# EAGLE design controllerboard (EAGLE 5.11)
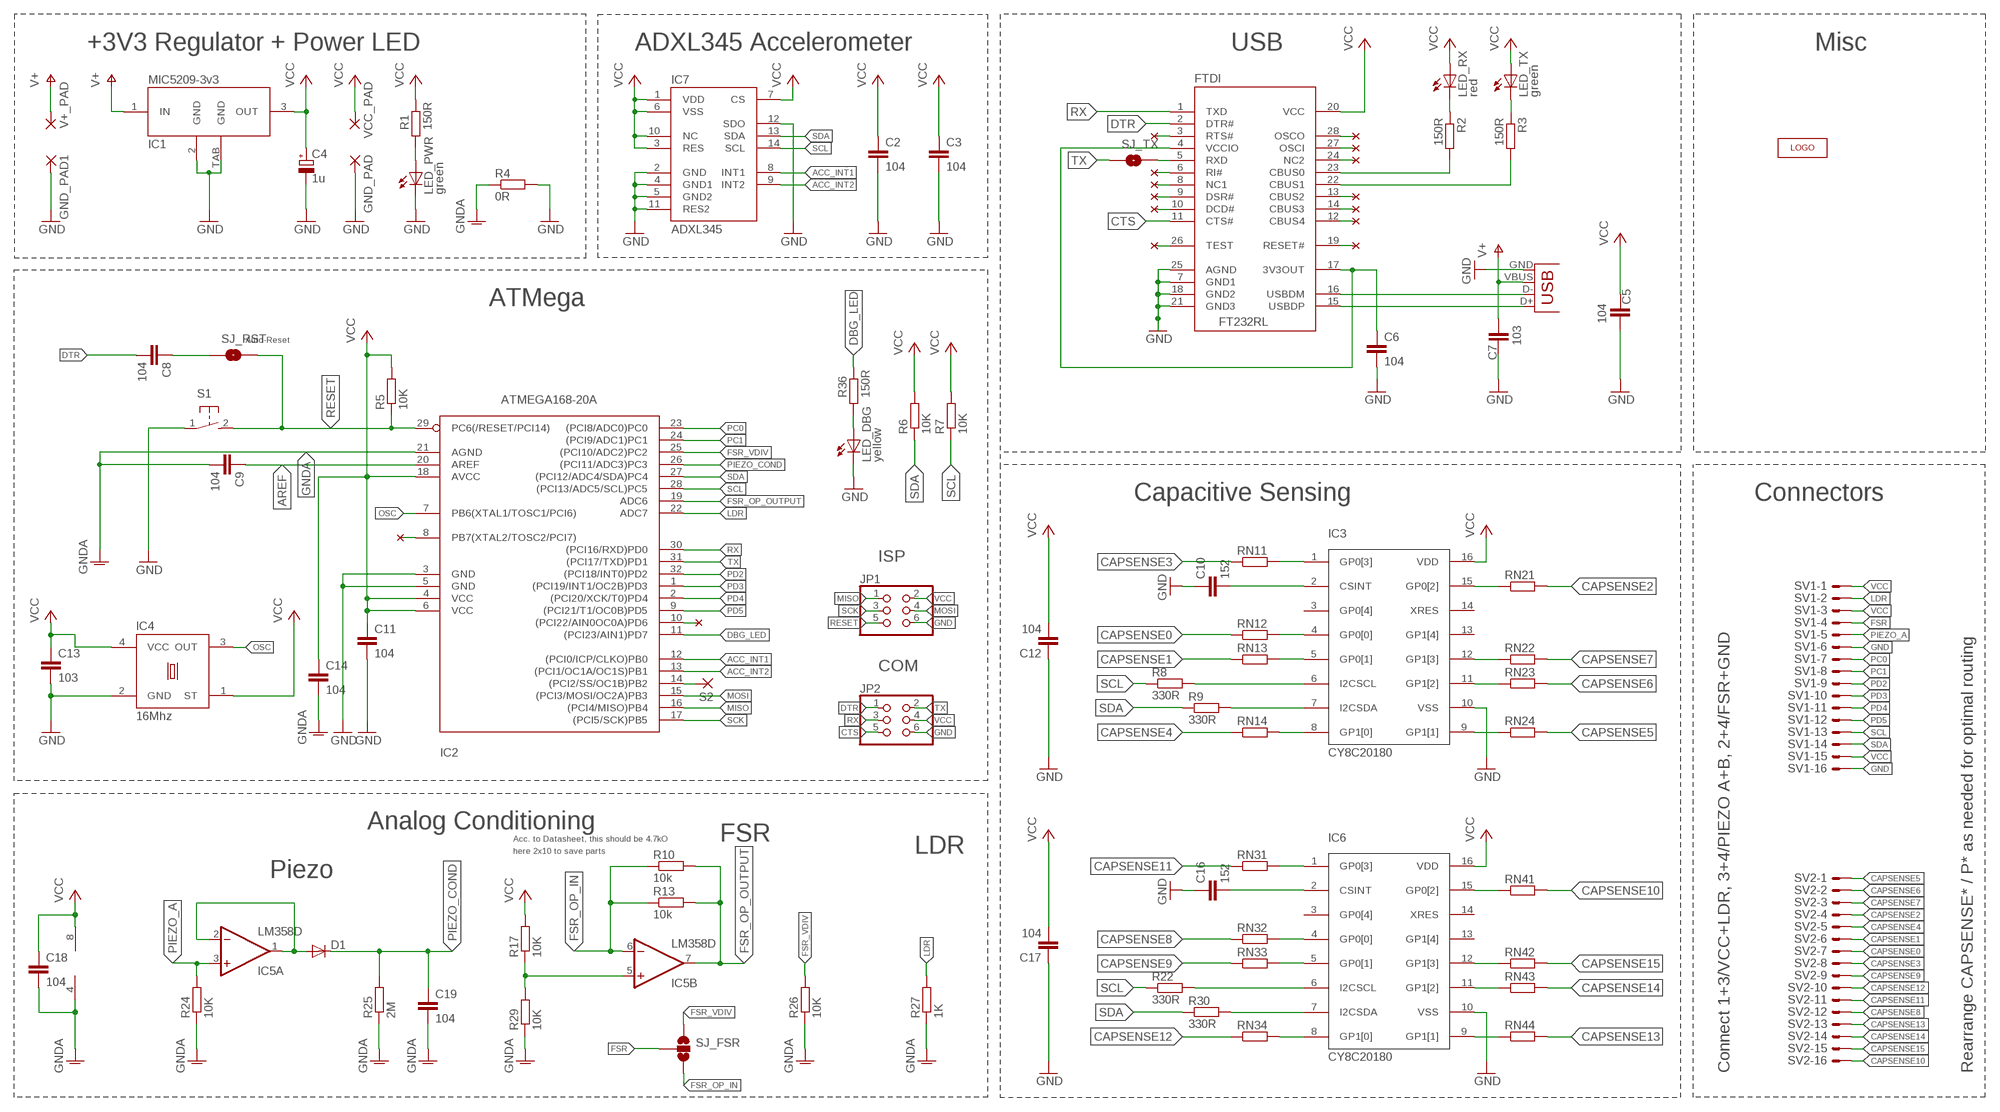
[diagram p0: schematic, sheet 1]

## Parts
C2  104  C-EUC0603K  [C0603K]
C3  104  C-EUC0603K  [C0603K]
C4  1u  CPOL-EUSMCA  [SMC_A]
C5  104  C-EUC0603K  [C0603K]
C6  104  C-EUC0603K  [C0603K]
C7  103  C-EUC0603K  [C0603K]
C8  104  C-EUC0603K  [C0603K]
C9  104  C-EUC0603K  [C0603K]
C10  152  C-EUC0603K  [C0603K]
C11  104  C-EUC0603K  [C0603K]
C12  104  C-EUC0603K  [C0603K]
C13  103  C-EUC0603K  [C0603K]
C14  104  C-EUC0603K  [C0603K]
C16  152  C-EUC0603K  [C0603K]
C17  104  C-EUC0603K  [C0603K]
C18  104  C-EUC0603K  [C0603K]
C19  104  C-EUC0603K  [C0603K]
D1  DIODESOD  [SOD-323]
FTDI  FT232RL  [SSOP28]
GND_PAD  WIREPADSMD1,27-254  [SMD1,27-2,54]
GND_PAD1  WIREPADSMD1,27-254  [SMD1,27-2,54]
IC1  MIC5209-3v3  MIC5209  [SOT223]
IC2  ATMEGA168-20A  [TQFP32-08]
IC3  CY8C20180  [SO16]
IC4  16Mhz  CB3  [CB3]
IC5  LM358D  [SO08]
IC6  CY8C20180  [SO16]
IC7  ADXL345  [LGA14]
JP1  PINHD-2X3  [2X03]
JP2  PINHD-2X3  [2X03]
LED_DBG  yellow  LEDCHIPLED_0603  [CHIPLED_0603]
LED_PWR  green  LEDCHIPLED_0603  [CHIPLED_0603]
LED_RX  red  LEDCHIPLED_0603  [CHIPLED_0603]
LED_TX  green  LEDCHIPLED_0603  [CHIPLED_0603]
R1  150R  R-EU_R0603  [R0603]
R2  150R  R-EU_R0603  [R0603]
R3  150R  R-EU_R0603  [R0603]
R4  0R  R-EU_R0603  [R0603]
R5  10K  R-EU_R0603  [R0603]
R6  10K  R-EU_R0603  [R0603]
R7  10K  R-EU_R0603  [R0603]
R8  330R  R-EU_R0603  [R0603]
R9  330R  R-EU_R0603  [R0603]
R10  10k  R-EU_R0603  [R0603]
R13  10k  R-EU_R0603  [R0603]
R17  10K  R-EU_R0603  [R0603]
R22  330R  R-EU_R0603  [R0603]
R24  10K  R-EU_R0603  [R0603]
R25  2M  R-EU_R0603  [R0603]
R26  10K  R-EU_R0603  [R0603]
R27  1K  R-EU_R0603  [R0603]
R29  10K  R-EU_R0603  [R0603]
R30  330R  R-EU_R0603  [R0603]
R36  150R  R-EU_R0603  [R0603]
RN1  RESISTOR_NETWORK_4-742C083  [742C083]
RN2  RESISTOR_NETWORK_4-742C083  [742C083]
RN3  RESISTOR_NETWORK_4-742C083  [742C083]
RN4  RESISTOR_NETWORK_4-742C083  [742C083]
S1  B3U-1000P  [B3U-1000P]
S2  PAD0.8X0.5  [PAD_0.8X0.5]
SJ_FSR  SOLDERJUMPER_2WAYPASTE1&2  [SJ_3_PASTE1&2]
SJ_RST  SOLDERJUMPERTRACE  [SJ_2S-TRACE]
SJ_TX  SOLDERJUMPERTRACE  [SJ_2S-TRACE]
SV1  ML16E  [ML16]
SV2  ML16E  [ML16]
U$1  LOGO  [LOGO]
V+_PAD  WIREPADSMD1,27-254  [SMD1,27-2,54]
VCC_PAD  WIREPADSMD1,27-254  [SMD1,27-2,54]
X2  USBSMD  [USB-MINIB]

## Nets
ACC_INT1: IC2.12((PCI0/ICP/CLKO)PB0) IC7.8(INT1)
ACC_INT2: IC2.13((PCI1/OC1A/OC1S)PB1) IC7.9(INT2)
AREF: C9.1 IC2.20(AREF)
CAPSENSE0: RN1.P$3 SV2.7
CAPSENSE1: RN1.P$5 SV2.6
CAPSENSE2: RN2.P$2 SV2.4
CAPSENSE3: RN1.P$1 SV2.8
CAPSENSE4: RN1.P$7 SV2.5
CAPSENSE5: RN2.P$8 SV2.1
CAPSENSE6: RN2.P$6 SV2.2
CAPSENSE7: RN2.P$4 SV2.3
CAPSENSE8: RN3.P$3 SV2.12
CAPSENSE9: RN3.P$5 SV2.9
CAPSENSE10: RN4.P$2 SV2.16
CAPSENSE11: RN3.P$1 SV2.11
CAPSENSE12: RN3.P$7 SV2.10
CAPSENSE13: RN4.P$8 SV2.13
CAPSENSE14: RN4.P$6 SV2.14
CAPSENSE15: RN4.P$4 SV2.15
CTS: FTDI.11(CTS#) JP2.5
DBG_LED: IC2.11((PCI23/AIN1)PD7) R36.2
DTR: C8.2 FTDI.2(DTR#) JP2.1
FSR: SJ_FSR.2 SV1.4
FSR_OP_IN: IC5.6(B:-IN) R10.1 R13.1 SJ_FSR.3
FSR_OP_OUTPUT: IC2.19(ADC6) IC5.7(B:OUT) R10.2 R13.2
FSR_VDIV: IC2.25((PCI10/ADC2)PC2) R26.2 SJ_FSR.1
GND: C2.2 C3.2 C4.- C5.2 C6.2 C7.1 C10.1 C11.2 C12.1 C13.2 C16.1 C17.1 FTDI.7(GND1) FTDI.18(GND2) FTDI.21(GND3) FTDI.25(AGND) GND_PAD1.1(P) GND_PAD.1(P) IC1.2(GND) IC1.TAB(GND) IC2.3(GND) IC2.5(GND) IC3.10(VSS) IC4.2(GND) IC6.10(VSS) IC7.2(GND) IC7.4(GND1) IC7.5(GND2) IC7.11(RES2) IC7.12(SDO) JP1.6 JP2.6 LED_DBG.C LED_PWR.C R4.2 S1.1 SV1.6 SV1.16 X2.GND
GNDA: C9.2 C14.2 C18.2 C19.2 IC2.21(AGND) IC5.4(P:V-) R4.1 R24.1 R25.1 R26.1 R27.1 R29.1
LDR: IC2.22(ADC7) R27.2 SV1.2
MISO: IC2.16((PCI4/MISO)PB4) JP1.1
MOSI: IC2.15((PCI3/MOSI/OC2A)PB3) JP1.4
N$1: D1.2(A) IC5.1(A:OUT) IC5.2(A:-IN)
N$2: LED_DBG.A R36.1
N$4: FTDI.5(RXD) SJ_TX.2
N$6: C6.1 FTDI.4(VCCIO) FTDI.17(3V3OUT)
N$7: IC5.5(B:+IN) R17.1 R29.2
N$8: IC3.1(GP0[3]) RN1.P$2
N$9: IC3.4(GP0[0]) RN1.P$4
N$10: IC3.5(GP0[1]) RN1.P$6
N$11: IC2.14((PCI2/SS/OC1B)PB2) S2.P$1(P)
N$12: IC3.8(GP1[0]) RN1.P$8
N$13: IC3.15(GP0[2]) RN2.P$1
N$14: IC3.12(GP1[3]) RN2.P$3
N$15: IC3.11(GP1[2]) RN2.P$5
N$16: IC3.9(GP1[1]) RN2.P$7
N$17: IC6.1(GP0[3]) RN3.P$2
N$18: IC6.4(GP0[0]) RN3.P$4
N$19: IC6.5(GP0[1]) RN3.P$6
N$20: C10.2 IC3.2(CSINT)
N$21: IC6.8(GP1[0]) RN3.P$8
N$22: IC6.15(GP0[2]) RN4.P$1
N$23: IC6.12(GP1[3]) RN4.P$3
N$24: IC6.11(GP1[2]) RN4.P$5
N$25: IC6.9(GP1[1]) RN4.P$7
N$27: IC2.10((PCI22/AIN0OC0A)PD6)
N$28: IC2.8(PB7(XTAL2/TOSC2/PCI7))
N$30: IC3.6(I2CSCL) R8.2
N$31: IC3.7(I2CSDA) R9.2
N$40: FTDI.15(USBDP) X2.D+
N$41: FTDI.16(USBDM) X2.D-
N$42: FTDI.23(CBUS0) R2.2
N$43: FTDI.22(CBUS1) R3.2
N$45: FTDI.6(RI#)
N$46: FTDI.8(NC1)
N$47: FTDI.9(DSR#)
N$48: FTDI.10(DCD#)
N$49: FTDI.28(OSCO)
N$50: FTDI.27(OSCI)
N$51: FTDI.24(NC2)
N$52: FTDI.13(CBUS2)
N$53: FTDI.14(CBUS3)
N$54: FTDI.12(CBUS4)
N$55: FTDI.19(RESET#)
N$56: FTDI.26(TEST)
N$57: FTDI.3(RTS#)
N$59: LED_RX.C R2.1
N$60: LED_TX.C R3.1
N$65: C16.2 IC6.2(CSINT)
N$66: IC6.6(I2CSCL) R22.2
N$67: IC6.7(I2CSDA) R30.2
N$68: LED_PWR.A R1.1
N$89: C8.1 SJ_RST.1
OSC: IC2.7(PB6(XTAL1/TOSC1/PCI6)) IC4.3(OUT)
PC0: IC2.23((PCI8/ADC0)PC0) SV1.7
PC1: IC2.24((PCI9/ADC1)PC1) SV1.8
PD2: IC2.32((PCI18/INT0)PD2) SV1.9
PD3: IC2.1((PCI19/INT1/OC2B)PD3) SV1.10
PD4: IC2.2((PCI20/XCK/T0)PD4) SV1.11
PD5: IC2.9((PCI21/T1/OC0B)PD5) SV1.12
PIEZO_A: IC5.3(A:+IN) R24.2 SV1.5
PIEZO_COND: C19.1 D1.1(C) IC2.26((PCI11/ADC3)PC3) R25.2
RESET: IC2.29(PC6(/RESET/PCI14)) JP1.5 R5.1 S1.2 SJ_RST.2
RX: FTDI.1(TXD) IC2.30((PCI16/RXD)PD0) JP2.3
SCK: IC2.17((PCI5/SCK)PB5) JP1.3
SCL: IC2.28((PCI13/ADC5/SCL)PC5) IC7.14(SCL) R7.1 R8.1 R22.1 SV1.13
SDA: IC2.27((PCI12/ADC4/SDA)PC4) IC7.13(SDA) R6.1 R9.1 R30.1 SV1.14
TX: IC2.31((PCI17/TXD)PD1) JP2.2 SJ_TX.1
V+: C7.2 IC1.1(IN) V+_PAD.1(P) X2.VBUS
VCC: C2.1 C3.1 C4.+ C5.1 C11.1 C12.2 C13.1 C14.1 C17.2 C18.1 FTDI.20(VCC) IC1.3(OUT) IC2.4(VCC) IC2.6(VCC) IC2.18(AVCC) IC3.16(VDD) IC4.1(ST) IC4.4(VCC) IC5.8(P:V+) IC6.16(VDD) IC7.1(VDD) IC7.3(RES) IC7.6(VSS) IC7.7(CS) IC7.10(NC) JP1.2 JP2.4 LED_RX.A LED_TX.A R1.2 R5.2 R6.2 R7.2 R17.2 SV1.1 SV1.3 SV1.15 VCC_PAD.1(P)
Unconnected: IC3.3(GP0[4]) IC3.13(GP1[4]) IC3.14(XRES) IC6.3(GP0[4]) IC6.13(GP1[4]) IC6.14(XRES)

## Notes on the sheet
- +3V3 Regulator + Power LED | ADXL345 Accelerometer | USB | Misc
- ATMega
- Auto-Reset
- Capacitive Sensing | Connectors
- ISP
- COM
- Analog Conditioning
- Acc. to Datasheet, this should be 4.7kO | FSR
- here 2x10 to save parts | LDR
- Piezo
- Connect 1+3/VCC+LDR, 3+4/PIEZO A+B, 2+4/FSR+GND | Rearrange CAPSENSE* / P* as needed for optimal routing

## Library data of the parts
C2 C3 C5-C14 C16-C19 = rcl:C-EU: CAPACITOR, European symbol
C4 = rcl:CPOL-EU: POLARIZED CAPACITOR, European symbol
D1 = SparkFun:DIODE: Diode These are standard reverse protection diodes and small signal diodes. SMA package can handle up to about 1A. SOD-323 can handle about 200mA. What the SOD-323 package when ordering, there are some mfgs out there that are 5-pin packages.
FTDI = MySMD:FT232RL
GND_PAD GND_PAD1 V+_PAD VCC_PAD = wirepad:WIREPAD: Wire PAD connect wire on PCB
IC1 = vreg:MIC5209: MIC5209 voltage regulator
IC2 = avr:ATMEGA168: MICROCONTROLLER 16 kBytes FLASH 1 kBytes SRAM 512 Bytes EEPROM USART 8-channel 10 bit ADC
IC3 IC6 = sensors:CY8C20180: Cypress CY8C20180 CapSense Express 8-Channel Capacitive Button Controler
IC4 = crystals:CB3: Model CB3 & CB3LV HCMOS/TTL CLOCK OSCILLATOR Standard 7.0x5.0mm Surface Mount Footprint HCMOS/TTL Compatible Fundamental and 3RD Overtone Crystals ? Frequency Range 1.5 ? 160 MHz Frequency Stability, ±50 ppm Standard (±25 ppm and ±20 ppm available) +3.3Vdc or +5.0Vdc Operation Datasheet <http://www.ctscorp.com/components/Datasheets/008-0256-0_F.pdf>
IC5 = linear:LM358: OP AMP also LM158; LM258; LM2904 Source: http://cache.national.com/ds/LM/LM158.pdf
IC7 = sensors:ADXL345: ADXL345 Digital 3-axis Accelerometer Original Footprint by SparkFun, revised & corrected.
JP1 JP2 = pinhead:PINHD-2X3: PIN HEADER
LED_DBG LED_PWR LED_RX LED_TX = led:LED: LED OSRAM: - CHIPLED LG R971, LG N971, LY N971, LG Q971, LY Q971, LO R971, LY R971 LH N974, LH R974 LS Q976, LO Q976, LY Q976 LO Q996 - Hyper CHIPLED LW Q18S LB Q993, LB Q99A, LB R99A - SideLED LS A670, LO A670, LY A670, LG A670, LP A670 LB A673, LV A673, LT A673, LW A673 LH A674 LY A675 LS A676, LA A676, LO A676, LY A676, LW A676 LS A679, LY A679, LG A679 - Hyper Micro SIDELED® LS Y876, LA Y876, LO Y876, LY Y876 LT Y87S - SmartLED LW L88C, LW L88S LB L89C, LB L89S, LG L890 LS L89K, LO L89K, LY L89K LS L896, LA L896, LO L896, LY L896 - TOPLED LS T670, LO T670, LY T670, LG T670, LP T670 LSG T670, LSP T670, LSY T670, LOP T670, LYG T670 LG T671, LOG T671, LSG T671 LB T673, LV T673, LT T673, LW T673 LH T674 LS T676, LA T676, LO T676, LY T676, LB T676, LH T676, LSB T676, LW T676 LB T67C, LV T67C, LT T67C, LS T67K, LO T67K, LY T67K, LW E67C LS E67B, LA E67B, LO E67B, LY E67B, LB E67C, LV E67C, LT E67C LW T67C LS T679, LY T679, LG T679 LS T770, LO T770, LY T770, LG T770, LP T770 LB T773, LV T773, LT T773, LW T773 LH T774 LS E675, LA E675, LY E675, LS T675 LS T776, LA T776, LO T776, LY T776, LB T776 LHGB T686 LT T68C, LB T68C - Hyper Mini TOPLED® LB M676 - Mini TOPLED Santana® LG M470 LS M47K, LO M47K, LY M47K Source: http://www.osram.convergy.de LUXEON: - LUMILED® LXK2-PW12-R00, LXK2-PW12-S00, LXK2-PW14-U00, LXK2-PW14-V00 LXK2-PM12-R00, LXK2-PM12-S00, LXK2-PM14-U00 LXK2-PE12-Q00, LXK2-PE12-R00, LXK2-PE12-S00, LXK2-PE14-T00, LXK2-PE14-U00 LXK2-PB12-K00, LXK2-PB12-L00, LXK2-PB12-M00, LXK2-PB14-N00, LXK2-PB14-P00, LXK2-PB14-Q00 LXK2-PR12-L00, LXK2-PR12-M00, LXK2-PR14-Q00, LXK2-PR14-R00 LXK2-PD12-Q00, LXK2-PD12-R00, LXK2-PD12-S00 LXK2-PH12-R00, LXK2-PH12-S00 LXK2-PL12-P00, LXK2-PL12-Q00, LXK2-PL12-R00 Source: www.luxeon.com KINGBRIGHT: KA-3528ASYC Source: www.kingbright.com
R1-R10 R13 R17 R22 R24-R27 R29 R30 R36 = rcl:R-EU_: RESISTOR, European symbol
RN1-RN4 = resistor:RESISTOR_NETWORK_4: Resistor Network/Array with 4 single resistors in a package
S1 = switch:B3U: Ultra-small Tactile Switch B3U Ultra-small-sized Tactile Switch with High Contact Reliability: 1.2 x 3 x 2.5 mm (H x W x D) Datasheet <http://components.omron.com/components/web/pdflib.nsf/0/2DD3893C7DD33E9E862572900079E9D6/$file/B3U_1110.pdf> Digi-Key Part Number SW1020CT-ND
S2 = connector:PAD
SJ_FSR = SparkFun:SOLDERJUMPER_2WAY: Solder Jumper 2 way solder jumper
SJ_RST SJ_TX = SparkFun:SOLDERJUMPER: Solder Jumper Standard SMD solder jumper. Used to automate production. Two varients : Normally Open and Normally Closed are the same, but have different paste layers. NC will have a large amount of paste and should jumper during reflow.
SV1 SV2 = con-harting-ml:ML16?E: HARTING; OC_FARNELL: unknown; OC_NEWARK: unknown
U$1 = own:LOGO
X2 = SparkFun:USB: USB Connectors USB-B-PTH is fully proven SKU : PRT-00139 USB-miniB is fully proven SKU : PRT-00587 USB-A-PCB is untested. USB-A-H is throughly reviewed, but untested. Spark Fun Electronics SKU : PRT-00437 USB-B-SMT is throughly reviewed, but untested. Needs silkscreen touching up. USB-A-S has not been used/tested USB-MB-H has not been used/tested

## Board
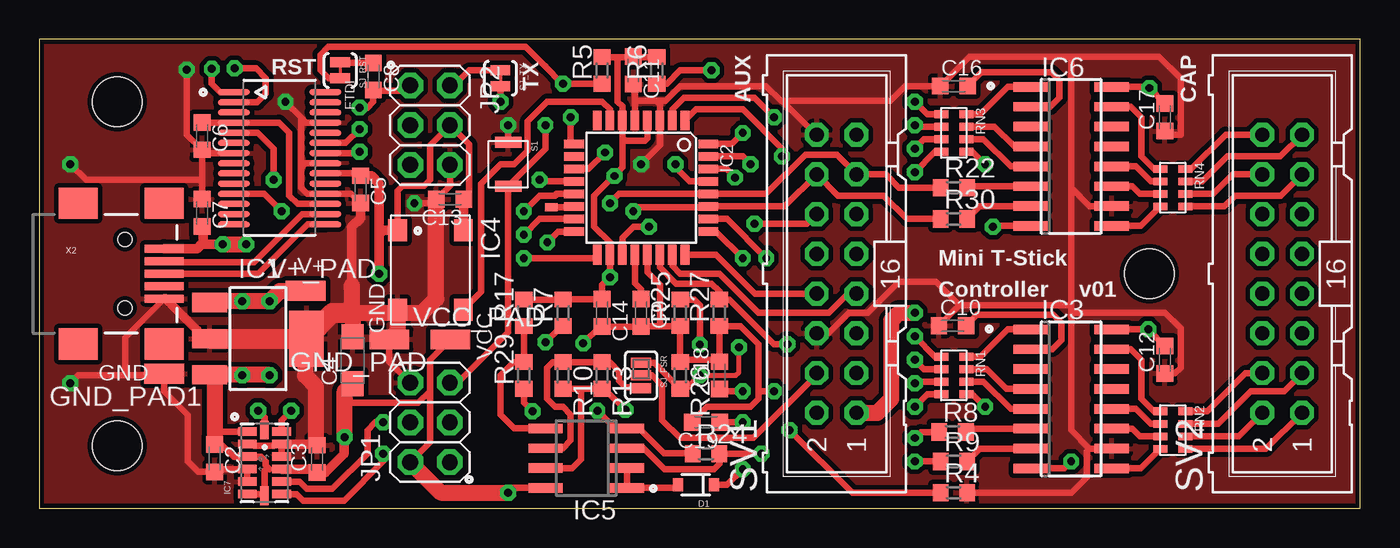
[diagram p1: board, top side]
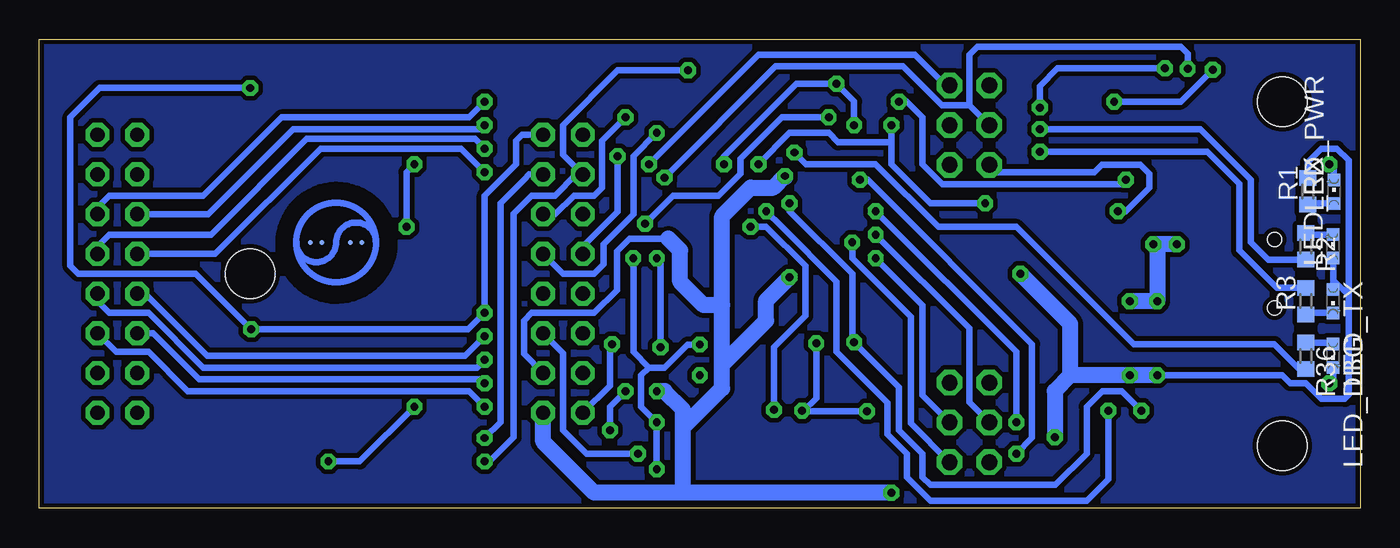
[diagram p2: board, bottom side, seen from below]

Size 84.5 x 30 mm. Coordinates in mm from the lower left corner, seen from the top.
Outline: 0,0 84.5,0 84.5,30 0,30 0,0
Copper layers (1*16): Top 0.035mm / dielectric 1.5mm / Bottom 0.035mm
Design rules "APC *": minimum track width 7mil, minimum drill 20mil, track to track 7mil, track to pad 7mil, pad to pad 7mil, via to via 7mil, smd to smd 0mil, copper to edge 8mil, drill to drill 8mil, minimum pad ring 12mil, minimum via ring 10mil, stop-mask expansion 4mil, vias tented up to drill 25mil, thermal gap 10mil
Holes 3.17 mm at 71,15 5,26 5,4
bRestrict: area 62.1,13.6 to 68.9,20.4

### Footprints (pad centres in the part's own frame; a part is rotated, then mirrored left to right if it is on the bottom)
C0603K = smd 1.05 x 1.08: 1 -0.875,0; 2 0.875,0
SMC_A = smd 1.6 x 1.4: + -1.5,0; - 1.5,0
SOD-323 = smd 0.63 x 0.83: 1 -1.15,0; 2 1.15,0
SSOP28 = smd 0.381 x 2.032: 1 0,0; 2 0.65,0; 3 1.3,0; 4 1.95,0; 5 2.6,0; 6 3.25,0; 7 3.9,0; 8 4.55,0; 9 5.2,0; 10 5.85,0; 11 6.5,0; 12 7.15,0; 13 7.8,0; 14 8.45,0; 15 8.45,5.848; 16 7.8,5.848; 17 7.15,5.848; 18 6.5,5.848; 19 5.85,5.848; 20 5.2,5.848; 21 4.55,5.848; 22 3.9,5.848; 23 3.25,5.848; 24 2.6,5.848; 25 1.95,5.848; 26 1.3,5.848; 27 0.65,5.848; 28 0,5.848
SMD1,27-2,54 = smd 1.27 x 2.54: 1 0,0
SOT223 = smd 1.219 x 2.235: 1 -2.311,-3.099; 2 0,-3.099; 3 2.311,-3.099 | smd 3.6 x 2.2: TAB 0,3.099
TQFP32-08 = smd 1.27 x 0.559: 1 -4.293,2.8; 2 -4.293,2; 3 -4.293,1.2; 4 -4.293,0.4; 5 -4.293,-0.4; 6 -4.293,-1.2; 7 -4.293,-2; 8 -4.293,-2.8; 17 4.293,-2.8; 18 4.293,-2; 19 4.293,-1.2; 20 4.293,-0.4; 21 4.293,0.4; 22 4.293,1.2; 23 4.293,2; 24 4.293,2.8 | smd 0.559 x 1.27: 9 -2.8,-4.293; 10 -2,-4.293; 11 -1.2,-4.293; 12 -0.4,-4.293; 13 0.4,-4.293; 14 1.2,-4.293; 15 2,-4.293; 16 2.8,-4.293; 25 2.8,4.293; 26 2,4.293; 27 1.2,4.293; 28 0.4,4.293; 29 -0.4,4.293; 30 -1.2,4.293; 31 -2,4.293; 32 -2.8,4.293
SO16 = smd 0.6 x 2.2: 1 -4.445,-2.6; 2 -3.175,-2.6; 3 -1.905,-2.6; 4 -0.635,-2.6; 5 0.635,-2.6; 6 1.905,-2.6; 7 3.175,-2.6; 8 4.445,-2.6; 9 4.445,2.6; 10 3.175,2.6; 11 1.905,2.6; 12 0.635,2.6; 13 -0.635,2.6; 14 -1.905,2.6; 15 -3.175,2.6; 16 -4.445,2.6
CB3 = smd 1.4 x 1.2: 1 -2.54,-2.1; 2 2.54,-2.1; 3 2.54,2.1; 4 -2.54,2.1
SO08 = smd 0.6 x 2.2: 1 -1.905,-2.6; 2 -0.635,-2.6; 3 0.635,-2.6; 4 1.905,-2.6; 5 1.905,2.6; 6 0.635,2.6; 7 -0.635,2.6; 8 -1.905,2.6
LGA14 = smd 0.55 x 1.2: 1 2,1.1; 2 1.2,1.1; 3 0.4,1.1; 4 -0.4,1.1; 5 -1.2,1.1; 6 -2,1.1; 8 -2,-1.1; 9 -1.2,-1.1; 10 -0.4,-1.1; 11 0.4,-1.1; 12 1.2,-1.1; 13 2,-1.1 | smd 1.2 x 0.55: 7 -2.1,0; 14 2.1,0
2X03 = drill 1.016 octagon: 1 -2.54,-1.27; 2 -2.54,1.27; 3 0,-1.27; 4 0,1.27; 5 2.54,-1.27; 6 2.54,1.27
CHIPLED_0603 = smd 0.8 x 0.8: A 0,-0.75; C 0,0.75
R0603 = smd 1 x 1.1: 1 -0.85,0; 2 0.85,0
742C083 = smd 0.5 x 0.9: P$1 -1.2,-0.8; P$2 -1.2,0.8; P$3 -0.4,-0.8; P$4 -0.4,0.8; P$5 0.4,-0.8; P$6 0.4,0.8; P$7 1.2,-0.8; P$8 1.2,0.8
B3U-1000P = smd 0.7 x 1.7: 1 -1.4,0; 2 1.4,0
PAD_0.8X0.5 = smd 0.8 x 0.5: P$1 0,0
SJ_3_PASTE1&2 = smd 0.635 x 1.27: 1 -0.813,0; 2 0,0; 3 0.813,0
SJ_2S-TRACE = smd 0.635 x 1.27: 1 -0.508,0; 2 0.508,0
ML16 = drill 0.914 octagon: 1 -8.89,-1.27; 2 -8.89,1.27; 3 -6.35,-1.27; 4 -6.35,1.27; 5 -3.81,-1.27; 6 -3.81,1.27; 7 -1.27,-1.27; 8 -1.27,1.27; 9 1.27,-1.27; 10 1.27,1.27; 11 3.81,-1.27; 12 3.81,1.27; 13 6.35,-1.27; 14 6.35,1.27; 15 8.89,-1.27; 16 8.89,1.27
LOGO = smd 0.305 x 0.305: P$1 -1.657,0; P$2 -0.921,0; P$3 0.921,0; P$4 1.657,0
USB-MINIB = smd 2.5 x 0.5: D+ 2.5,0; D- 2.5,0.8; GND 2.5,-1.6; ID 2.5,-0.8; VBUS 2.5,1.6 | smd 2.5 x 2: MTN1 -3,4.5; MTN2 2.5,4.5; MTN3 -3,-4.5; MTN4 2.5,-4.5 | hole 0.9: 0,2.2; 0,-2.2

### Placement (x,y rotation side)
C2  11.23,3.21 270 top
C3  17.77,3.16 90 top
C4  20.05,9.46 90 top
C5  20.55,20.39 270 top
C6  10.42,23.8 270 top
C7  10.43,18.89 270 top
C8  21.38,27.61 270 top
C9  38.5,12.5 270 top
C10  58.42,11.68 0 top
C11  38,28 270 top
C12  72,9.5 90 top
C13  26.27,19.75 180 top
C14  36,12.5 270 top
C16  58.5,27 0 top
C17  72,25 90 top
C18  43.5,8.5 90 top
C19  42.65,5.5 180 top
D1  42,1.5 180 top
FTDI  12.45,26.61 270 top
GND_PAD  22.4,10.8 90 top
GND_PAD1  8,8.61 90 top
IC1  14,10.85 270 top
IC2  38.5,20.5 270 top
IC3  66,7 270 top
IC4  25.02,15.25 270 top
IC5  34.99,3.21 90 top
IC6  66,22.5 270 top
IC7  14.42,2.91 90 top
JP1  25,5.5 90 top
JP2  25,24.5 270 top
LED_DBG  1.75,9.75 180 bottom
LED_PWR  1.69,20.25 0 bottom
LED_RX  1.75,16.75 0 bottom
LED_TX  1.75,13.25 180 bottom
R1  3.36,20.27 90 bottom
R2  3.5,16.75 270 bottom
R3  3.5,13.25 90 bottom
R4  58.5,1 0 top
R5  36,28 90 top
R6  39.5,28 90 top
R7  33.5,12.5 90 top
R8  58.42,4.88 0 top
R9  58.5,3 0 top
R10  33.5,8.5 270 top
R13  36,8.5 270 top
R17  31,12.5 90 top
R22  58.5,20.5 0 top
R24  42.65,3.5 0 top
R25  41,12.5 90 top
R26  41,8.5 270 top
R27  43.5,12.5 90 top
R29  31,8.5 90 top
R30  58.5,18.5 0 top
R36  3.5,9.75 270 bottom
RN1  58.5,8.5 270 top
RN2  72.5,5 270 top
RN3  58.5,24 270 top
RN4  72.5,20.5 270 top
S1  30,22 270 top
S2  32.75,19.25 0 top
SJ_FSR  38.5,8.5 270 top
SJ_RST  19.25,28 270 top
SJ_TX  29.5,27.5 270 top
SV1  51,15 90 top
SV2  79.5,15 90 top
U$1  65.5,17 0 bottom
V+_PAD  17.05,13.91 270 top
VCC_PAD  26.3,10.8 270 top
X2  5.5,15 0 top

### Tracks (layer width: path | path; a pad name or v marks a point on that pad's centre or on a via)
ACC_INT1  (via drill 0.51)
  Top 0.406: IC7.8 16.46,0.91 16.88,0.5 19.5,0.5 22,3 v22,3.5 | IC2.12 32.1,20.9 v32,21
  Bottom 0.406: v32,21 31.5,21 21,10.5 21,4.5 v22,3.5
ACC_INT2  (via drill 0.51)
  Top 0.406: IC7.9 16.66,1.71 17.12,1.25 18.75,1.25 21,3.5 21,5 21.5,5.5 v22,5.5 | IC2.13 33.1,20.1 33,20 32,20 v31,19
  Bottom 0.406: v22,5.5 22,10 v31,19
AREF
  Top 0.406: IC2.20 38.1,14.4 38.5,14 C9.1
CAPSENSE0  (via drill 0.51)
  Top 0.406: RN1.P$3 56.6,8.9 v56,9.5
  Bottom 0.406: v56,9.5 56.5,9 74,9 77.5,12.5 80,12.5 80.77,13.27 SV2.7
CAPSENSE1  (via drill 0.51)
  Top 0.406: RN1.P$5 56.1,8.1 v56,8
  Bottom 0.406: v56,8 56.25,8.25 74.25,8.25 77.19,11.19 SV2.6
CAPSENSE2
  Top 0.406: SV2.4 77.15,8.65 74.7,6.2 RN2.P$2
CAPSENSE3  (via drill 0.51)
  Top 0.406: RN1.P$1 57.3,9.7 v56,11
  Bottom 0.406: v56,11 57.25,9.75 73.75,9.75 77.73,13.73 SV2.8
CAPSENSE4  (via drill 0.51)
  Top 0.406: RN1.P$7 56.8,7.3 v56,6.5
  Bottom 0.406: v56,6.5 57,7.5 75,7.5 77.5,10 79.58,10 SV2.5
CAPSENSE5
  Top 0.406: RN2.P$8 78.46,3.8 SV2.1
CAPSENSE6
  Top 0.406: RN2.P$6 76.72,4.6 SV2.2
CAPSENSE7
  Top 0.406: RN2.P$4 75.4,5.4 77.5,7.5 79.62,7.5 SV2.3
CAPSENSE8  (via drill 0.51)
  Top 0.406: RN3.P$3 56.1,24.4 v56,24.5
  Bottom 0.406: SV2.12 73.69,18.81 68.25,24.25 58.88,24.25 58.5,24.25 56.25,24.25 v56,24.5
CAPSENSE9  (via drill 0.51)
  Top 0.406: RN3.P$5 56.6,23.6 v56,23
  Bottom 0.406: SV2.9 80.77,16.73 80,17.5 73.5,17.5 67.38,23.62 59.5,23.62 59,23.62 56.62,23.62 v56,23
CAPSENSE10
  Top 0.406: RN4.P$2 73.7,21.7 75.89,23.89 SV2.16
CAPSENSE11  (via drill 0.51)
  Top 0.406: RN3.P$1 56.8,25.2 v56,26
  Bottom 0.406: SV2.11 80.77,19.23 80,20 74,20 69,25 57,25 v56,26
CAPSENSE12  (via drill 0.51)
  Top 0.406: RN3.P$7 57.3,22.8 v56,21.5
  Bottom 0.406: SV2.10 73.23,16.27 66.5,23 61,23 60.5,23 57.5,23 v56,21.5
CAPSENSE13
  Top 0.406: RN4.P$8 75.8,19.3 76.5,20 79.42,20 SV2.13
CAPSENSE14
  Top 0.406: RN4.P$6 75.1,20.1 76.35,21.35 SV2.14
CAPSENSE15
  Top 0.406: SV2.15 79.38,22.5 76,22.5 74.4,20.9 RN4.P$4
CTS  (via drill 0.51)
  Top 0.406: FTDI.11 14.39,20.11 v15.5,19
  Bottom 0.406: v15.5,19 15,19 13.5,20.5 13.5,21.4 14.06,21.96 16.54,21.96 17,21.5 23.27,21.5 JP2.5
DBG_LED  (via drill 0.51)
  Top 0.406: IC2.11 35.15,21.7 v36.2,22.75
  Bottom 0.406: R36.2 3.9,8.9 5.5,10.5 14.5,10.5 22,18 27,18 31,22 35.45,22 v36.2,22.75
DTR  (via drill 0.51)
  Top 0.406: JP2.1 23.82,27.04 23.48,26.7 21.41,26.7 C8.2 21.38,26 21,25.62 v20.5,25.62 | FTDI.2 13.96,25.96 14.5,26.5 14.5,27.5 13.88,28.12 v12.5,28.12
  Bottom 0.406: v20.5,25.62 20.5,27 19.38,28.12 v12.5,28.12
FSR
  Top 0.406: SV1.4 49.73,8.55 45.68,4.5 41,4.5 39.85,5.65 39.85,7.85 39.2,8.5 SJ_FSR.2
FSR_OP_IN
  Top 0.406: IC5.6 33.49,3.85 34,4.35 34,6 33.5,6.5 33,6.5 32.5,7 32.5,9 32.85,9.35 R10.1 R13.1 36.04,9.31 36.54,9.31 37.1,8.75 37.1,8.15 37.5,7.75 38.44,7.75 SJ_FSR.3
FSR_OP_OUTPUT  (via drill 0.51)
  Top 0.406: 34.65,7.65 R10.2 | 34.65,7.65 R13.2 36.15,7.5 36.3,7.5 v37.5,6.3 | 37.25,16.16 IC2.19 37.3,17.3 38,18 v39,18 | IC5.7 34.08,2.58 34.65,3.15 34.65,7.65
  Bottom 0.406: v37.5,6.3 37.5,10.3 35.5,12.3 35.5,15.5 38,18 v39,18
FSR_VDIV  (via drill 0.51)
  Top 0.305: v44.75,10.3 44.75,8.7 44.55,8.5 v42.25,8.5
  Top 0.406: 40.96,7.69 R26.2 | 40.96,7.69 41.44,7.69 v42.25,8.5 | IC2.25 43.3,17.7 v45,16 | 40.96,7.69 39.34,9.31 SJ_FSR.1
  Bottom 0.406: v44.75,10.3 44.75,15.75 v45,16
GND  (via drill 0.51)
  Top 0.406: 16.75,21.75 16.75,20.5 17.14,20.11 FTDI.18 19.95,20.11 C5.2 | FTDI.21 17.06,22.06 16.75,21.75 | FTDI.7 10.63,22.71 C6.2 | 16.75,21.75 16.75,25 | 16.75,25 v15.75,26 | 10.43,21 C7.1 | 10.43,21 10.43,22.91 C6.2 | IC7.11 IC7.12 15.11,4.11 15,4 13.75,4 13.64,4.11 IC7.2 | IC7.5 IC7.4 11.38,2.51 11.38,2.48 C2.2 10.16,2.33 9.5,3 9.5,6 8,7.5 GND_PAD1.1 7.99,8.62 7.38,8.62 7.25,8.5 5.5,8.5 | 17.7,4.11 C3.2 | C6.2 10.07,22.93 | 20.01,13.83 20.01,13.99 | 66,28.88 59.5,28.88 C16.1 55.38,27 54.44,26.06 47.5,26.06 | 66,28.88 66,20.5 | 66,20.5 67.17,19.32 IC6.10 | C17.1 72.23,23.89 73,23.89 73,27.5 71.62,28.88 66,28.88 | 58.87,13 C10.1 | 66,13 58.87,13 | 66,13 66,12.5 | 66,12.5 72,12.5 73,11.5 73,9 72.62,8.62 C12.1 | 66,20.5 66,13 | 66,12.5 66,5 67.17,3.83 | 67.17,3.83 IC3.10 | C11.2 38.1,27.02 38.1,26.06 | 38.1,26.06 IC2.5 | 39.44,26.06 38.1,26.06 | 39.44,26.06 39.7,25.8 IC2.3 39.7,23.2 | 39.44,26.06 40.06,26.06 41,27 46.5,27 47.44,26.06 47.5,26.06 | JP1.6 22.4,9.37 GND_PAD.1 | 30,23.5 29.5,23.5 | 30.5,23.5 30.4,23.4 S1.1 30,23.5 | C13.2 25.4,19.6 | v30,24.5 30,23.5 | C13.2 26.27,20.62 JP2.6 | FTDI.25 17.09,24.66 16.75,25 | v24,19.5 25.15,19.5 C13.2 | SV1.16 49.67,23.89 47.5,26.06 | 58.87,13 57.37,14.5 55,14.5 54.5,14 53,12.5 51.8,12.5 50.49,11.19 SV1.6 | v2,22 3,21 10.43,21 | v2,8 2.5,8.5 5.5,8.5 | 5.5,8.5 5.5,10.9 X2.GND | R4.2 66,1 67,2 67,3.65 67.17,3.83 | 39.7,23.2 | v38.5,22 39.7,23.2 | v9.45,28.05 9.45,23.89 C6.2
  Top 0.61: 17.7,4.11 IC7.12 | C5.2 20.55,18.55 20,18 20,14.25 | IC4.2 23.14,12.5 | X2.GND 8.1,13.4 10.12,11.38 10.12,11 10.38,10.75 10.8,10.75 IC1.2
  Top 1.016: 20.01,12.5 20.01,13.83 | 20.01,12.5 22.71,12.5 IC4.2 22.93,11.32 GND_PAD.1 | 23.14,12.5 24.5,12.5 25.4,13.4 C13.2 | 17.38,9.88 17.38,9.98 17.67,10.28 IC1.TAB 17,10.75 17,8.5 17.7,7.8 17.7,4.11 | C4.- 20.05,12.46 20.01,12.5 | 20,14.25 20,14 20.01,13.99
  Top 1.27: IC1.2 IC1.TAB 18.75,12.5 20.01,12.5
  Bottom 0.406: LED_PWR.C 1.69,21.69 v2,22 | LED_DBG.C 1.75,8.25 v2,8 | v24,19.5 27.5,19.5 30,22 S1.1 | v38.5,22 36.5,24 34,24 33.4,23.4 S1.1 | S1.1 v30,24.5 | v15.75,26 11.5,26 v9.45,28.05
  pour Top (isolate 0.305): 0,30 84.5,30 84.5,0 0,0
GNDA  (via drill 0.51)
  Top 0.406: R24.1 41.77,3.52 39.98,3.52 38.5,5 37.7,5 IC5.4 | C18.2 R27.1 44.85,11.65 46,10.5 46,7.5 | R29.1 31,6.75 v31.55,6.2 | IC5.4 | C19.2 41.77,5.58 42.7,6.5 45.5,6.5 46,7 46,7.5 | C18.2 43.52,9.35 | C18.2 43.38,9.5 41.15,9.5 R26.1 R25.1 39.7,11.65 | R4.1 52,1 v48,5 | 46,7.5 v47,7.5 | IC5.4 36.84,5.12 v35.7,6.25 | 39.7,11.65 38.52,11.65 C9.2 C14.2 35.88,11.62 v34.8,10.55 | IC2.21 38.9,15.1 39.7,14.3 39.7,11.65
  Bottom 0.406: v48,5 48,6.5 v47,7.5 | v31.55,6.2 35.65,6.2 | 35.65,6.2 v35.7,6.25 | 35.65,6.2 34.8,7.05 v34.8,10.55
LDR  (via drill 0.51)
  Top 0.406: IC2.22 39.7,15.4 40.73,14.38 43,14.38 43.5,13.88 R27.2 44.15,13.35 47,10.5 v47.85,10.5
  Bottom 0.406: SV1.2 48,7.84 48,10.35 v47.85,10.5
MISO  (via drill 0.51)
  Top 0.406: IC2.16 33.2,17.7 v32.5,17
  Bottom 0.406: v32.5,17 32.5,16 28.75,12.25 28.75,5.44 JP1.1
MOSI  (via drill 0.51)
  Top 0.406: IC2.15 32,18.5 v31,17.5
  Bottom 0.406: v31,17.5 25,11.5 25,6.77 JP1.4
N$1
  Top 0.406: IC5.2 IC5.1 40.66,1.3 D1.2
N$2
  Bottom 0.406: R36.1 1.85,10.6 LED_DBG.A
N$4  (via drill 0.51)
  Top 0.406: v29.5,26 SJ_TX.2 | v15,21 15,23 13.99,24.01 FTDI.5
  Bottom 0.406: v29.5,26 29,26 28,25 28,22 26.73,20.73 15.28,20.73 v15,21
N$5
  pour Bottom (isolate 0.305): 0,30 84.5,30 84.5,0 0,0
N$6
  Top 0.406: FTDI.17 16.54,19.46 16,20 16,24 15.34,24.66 FTDI.4 10.44,24.66 C6.1
N$7
  Top 0.406: R17.1 R29.2 30.35,9.35 29.5,8.5 29.5,6 30.39,5.12 IC5.5
N$8
  Top 0.406: IC3.1 61.95,11.45 60.2,9.7 RN1.P$2
N$9
  Top 0.406: RN1.P$4 60.6,8.9 61.87,7.63 IC3.4
N$10
  Top 0.406: IC3.5 62.13,6.37 60.4,8.1 RN1.P$6
N$11
  Top 0.406: S2.P$1 34.21,19.25 IC2.14
N$12  (via drill 0.51)
  Top 0.406: RN1.P$8 59.7,7.3 v60.5,6.5 | v66,3 65.56,2.56 IC3.8
  Bottom 0.406: v60.5,6.5 64,3 v66,3
N$13
  Top 0.406: IC3.15 69.83,10.18 70.5,9.5 70.5,7 71.3,6.2 RN2.P$1
N$14
  Top 0.406: RN2.P$3 71.1,5.4 70.14,6.37 IC3.12
N$15
  Top 0.406: RN2.P$5 70.4,4.6 69.91,5.09 IC3.11
N$16
  Top 0.406: RN2.P$7 70.45,2.56 IC3.9
N$17
  Top 0.406: IC6.1 61.95,26.95 60.2,25.2 RN3.P$2
N$18
  Top 0.406: RN3.P$4 61.1,24.4 62.37,23.14 IC6.4
N$19
  Top 0.406: RN3.P$6 60.4,23.6 62.13,21.86 IC6.5
N$20
  Top 0.406: C10.2 59.99,12.38 64.88,12.38 65.38,11.88 65.38,10.75 64.8,10.18 IC3.2
N$21  (via drill 0.51)
  Top 0.406: RN3.P$8 59.7,22.8 v60.5,22 | v61,18 61.05,18.05 IC6.8
  Bottom 0.406: v60.5,22 61,21.5 v61,18
N$22
  Top 0.406: IC6.15 69.83,25.68 70.5,25 70.5,22.5 71.3,21.7 RN4.P$1
N$23
  Top 0.406: RN4.P$3 71.1,20.9 70.14,21.86 IC6.12
N$24
  Top 0.406: IC6.11 69.91,20.59 70.4,20.1 RN4.P$5
N$25
  Top 0.406: RN4.P$7 70.45,18.05 IC6.9
N$30
  Top 0.406: IC3.6 59.48,5.09 R8.2
N$31
  Top 0.406: R9.2 60.17,3.83 IC3.7
N$40
  Top 0.406: FTDI.15 17.16,18.16 14,15 X2.D+ 7.93,15
N$41
  Top 0.406: FTDI.16 16.81,18.81 13.75,15.75 7.96,15.75 X2.D-
N$42  (via drill 0.51)
  Top 0.406: FTDI.23 19.61,23.36 v20.5,24.25
  Bottom 0.406: R2.2 5.9,15.9 7,17 7,21 10.25,24.25 v20.5,24.25
N$43  (via drill 0.51)
  Top 0.406: FTDI.22 20.41,22.71 v20.5,22.8
  Bottom 0.406: R3.2 5.35,14.1 7.75,16.5 7.75,20.75 9.8,22.8 v20.5,22.8
N$59
  Bottom 0.406: LED_RX.C 3.4,17.5 R2.1
N$60
  Bottom 0.406: LED_TX.C 3.4,12.5 R3.1
N$65
  Top 0.406: C16.2 60.25,27.88 64.75,27.88 65.25,27.38 65.25,26.25 64.67,25.68 IC6.2
N$66
  Top 0.406: IC6.6 59.45,20.59 R22.2
N$67
  Top 0.406: R30.2 60.17,19.32 IC6.7
N$68
  Bottom 0.406: LED_PWR.A 3.28,19.5 R1.1
N$89
  Top 0.406: SJ_RST.1 19.5,28.51 19.5,28.5 21.38,28.5 C8.1
OSC
  Top 0.406: IC2.7 36.5,25.5 36,26 32.5,26 31.25,24.75 31.25,22.88 30.38,22 29.5,22 28.25,20.75 28.25,13.84 IC4.3
  Top 0.61: 27.12,12.35 IC4.3
PC0
  Top 0.406: IC2.23 40.5,15.5 41,15 43.5,15 | 43.5,15 | 43.5,15 46,12.5 50.5,12.5 51.73,13.73 SV1.7
PC1
  Top 0.406: SV1.8 45.77,13.73 43.29,16.21 IC2.24
PD2  (via drill 0.51)
  Top 0.406: IC2.32 44.3,23.3 v45,24
  Bottom 0.406: 46.5,19.5 | v45,24 46.5,22.5 46.5,19.5 | 46.5,19.5 46.5,18.8 48.4,16.9 48.4,15.6 49,15 51,15 SV1.9
PD3  (via drill 0.51)
  Top 0.406: IC2.1 42,25.5 45,25.5 47.5,23 v47.5,22.5
  Bottom 0.406: v47.5,22.5 47.5,18.95 49.73,16.72 SV1.10
PD4  (via drill 0.51)
  Top 0.406: IC2.2 40.5,25.5 41.25,26.25 45.75,26.25 v47,25
  Bottom 0.406: 48.5,23.5 48.5,20.5 49,20 50.3,20 51.49,18.81 SV1.11 | 48.5,23.5 | v47,25 48.5,23.5
PD5  (via drill 0.51)
  Top 0.406: IC2.9 34,23.51 v34,25 | v45.75,18.2 49.12,18.2 SV1.12
  Bottom 0.406: v34,25 37,25 39.65,22.35 39.65,21.4 41.05,20 43.95,20 v45.75,18.2
PIEZO_A  (via drill 0.51)
  Top 0.406: IC5.3 38.66,3.85 40,2.5 43.15,2.5 43.5,2.85 R24.2 v46.2,3.5
  Bottom 0.406: v46.2,3.5 49.5,3.5 51,5 51,9.92 SV1.5
PIEZO_COND  (via drill 0.51)
  Top 0.406: v45,5.5 C19.1 | v46.5,16 44,18.5 IC2.26 | R25.2 41.9,13.35 42.25,13 v42.25,10.47 | D1.1 44,1.5 v45,2.5
  Bottom 0.406: 46.5,12 v46.5,16 | v45,5.5 | v45,5.5 46,6.5 46,8.5 45.5,9 | v45,2.5 | v45,2.5 v45,5.5 | v42.25,10.47 43.02,10.47 44.5,9 45.5,9 | 45.5,9 46.5,10 46.5,12 | 46.5,12
RESET  (via drill 0.51)
  Top 0.406: S1.2 30.1,20.6 | S1.2 30,11.27 26.77,8.04 JP1.5 | 32.35,28.25 33.45,27.15 v33.5,27.15 R5.1 | 32.35,28.25 32.38,28.25 | v32.38,24.5 32.38,22.98 S1.2 | SJ_RST.2 18.51,27.49 18,28 18,29 18.5,29.5 31.1,29.5 32.35,28.25 | IC2.29 41.6,20.9 40.7,21.8 v40.7,22
  Bottom 0.406: v32.38,24.5 32.38,26.02 v33.5,27.15 36.05,27.15 40.7,22.5 v40.7,22
RX  (via drill 0.51)
  Top 0.406: FTDI.1 11.59,26.61 11.05,27.15 v11.05,28.1 | v44.5,21.15 43.95,21.7 IC2.30
  Bottom 0.406: 25,25.77 25,29 24.5,29.5 11.5,29.5 11.05,29.05 v11.05,28.1 | 25,25.77 JP2.3 | 25,25.77 26.77,25.77 29.25,28.25 37.4,28.25 v44.5,21.15
SCK  (via drill 0.51)
  Top 0.406: v31,16 35.49,16 IC2.17
  Bottom 0.406: JP1.3 28,7.23 28,13 v31,16
SCL  (via drill 0.51)
  Top 0.406: IC7.14 14.42,5.83 v14,6.25 | R22.1 55,20.5 54.15,21.35 SV1.13 51.02,22.6 49,22.6 46.5,20.1 IC2.28 | R8.1 56.38,4.88 v56,4.5 | IC2.28 42.77,20.12 | IC2.28 37.1,20.1 v36.5,19.5 | R7.1 33.4,11.65 v32.38,10.62
  Bottom 0.406: v56,4.5 55,5.5 55,19.5 53.5,21 53.15,21.35 SV1.13 | v14,6.25 15.25,7.5 16.5,7.5 17.5,6.5 17.5,3.5 19.5,1.5 27.5,1.5 28,2 28,3.5 29.5,5 29.5,7.75 v32.38,10.62 32.5,10.75 32.5,15 36.5,19 v36.5,19.5
SDA  (via drill 0.51)
  Top 0.406: IC7.13 15.52,5.64 v16.12,6.25 | R6.1 40.15,27.15 41,28 v43,28 | 57.34,18.81 R30.1 55.5,18.5 54,20 51.08,20 SV1.14 47.68,19.3 IC2.27 42.74,19.25 38.25,19.25 v38,19 | v56,3 R9.1
  Bottom 0.406: v16.12,6.25 16.12,1.88 17.5,0.5 27.5,0.5 29,2 29,3.5 30.25,4.75 30.25,6.75 33.5,10 33.5,14.5 37,18 v38,19 | v43,28 47.5,28 51,24.5 51,22.62 SV1.14 50.15,21.35 51.5,20 53,20 54.15,18.85 54.15,4.55 55.7,3 v56,3
TX  (via drill 0.51)
  Top 0.406: SJ_TX.1 27.5,28 26.54,27.04 JP2.2 | v45.5,22 45,22.5 IC2.31
  Bottom 0.406: JP2.2 26.54,27.04 28.5,29 38.5,29 v45.5,22
V+  (via drill 0.51)
  Top 0.61: 10.5,17 10.5,17.95 C7.2 | X2.VBUS 10.1,16.6 10.5,17 | v11.75,16.88 10.62,16.88 10.5,17
  Top 1.016: v11.75,16.88 v13.25,16.88 | IC1.1 10.99,13.25 v14.75,13.25 15.41,13.91 V+_PAD.1
  Bottom 1.016: v14.75,13.25 v13,13.25 13,16.62 v13.25,16.88 v11.75,16.88
VCC  (via drill 0.51)
  Top 0.406: FTDI.20 20.45,21.41 20.45,21.37 C5.1 | 11.75,4 12.44,3.31 IC7.3 14.19,3.31 14.5,3 14.5,2.75 14.62,2.62 | 11.75,4 11.29,4 | IC7.1 11.66,4.91 11.25,4.5 | 11.25,4.5 11.25,4.08 | 11.25,4.5 11,4.5 11,4.32 C2.1 | 11.25,4.5 11.75,4 | 14.62,2.62 14.74,2.51 | 14.62,2.62 14.42,2.42 IC7.7 14.32,0.91 IC7.6 | 17.8,2.25 C3.1 17.55,2.51 17.5,2.51 | IC6.16 70.93,26.95 v71,26.88 C17.2 | IC3.16 v70.93,11.45 C12.2 | 37.3,23.7 IC2.6 37.3,25.7 37,26 37,28.85 | 37.3,23.7 37.5,23.5 38.75,23.5 38.9,23.65 IC2.4 | 37,28.85 R5.2 | 37,28.85 37.98,28.85 C11.1 38.02,28.85 R6.2 | VCC_PAD.1 25,9.5 25,7.5 | 25,7.5 24.25,6.75 19.8,6.75 19.55,7 | C13.1 27.5,20.1 27.5,23.27 JP2.4 25,23.23 25,21 24.62,20.62 23.25,20.62 22.93,20.3 IC4.1 | 43.5,7.75 C18.1 43.62,7.5 v45,7.5 | IC2.18 36.5,17 | 37.3,23.7 37.3,21.8 35.5,20 35.5,18 36.5,17 | JP1.2 25,4.23 25,7.5 | 19.55,7.5 20.01,7.96 C4.+ | v30,1 30.3,1.3 IC5.8 | IC2.18 36.5,17 | R17.2 R7.2 33.52,13.38 C14.1 36,14.28 v36.5,14.78 IC2.18
  Top 0.61: IC7.10 17.5,2.51 17.57,2.51 | C13.1 27.15,17.82 IC4.4 | C5.1 20.57,21.25 21.25,21.25 21.75,20.75 21.75,17.5 | v21.75,15 21.75,17.5 | IC4.1 22.04,17.79 21.75,17.5 | C3.1 18.29,2.29 19.5,3.5 19.5,4.5 v19.55,4.55
  Top 1.016: C2.1 11.23,8.21 IC1.3 14.71,8.54 arc-90 v14.75,8.5 | v19.55,4.55 19.55,7 19.55,7.5 | SV1.1 53.61,6.11 54.5,7 54.5,12 55,12.5 v56,12.5 | JP1.2 25.69,1 v30,1
  Bottom 0.406: 1.75,14.5 LED_TX.A | 1.75,14.5 LED_RX.A | v71,26.88 80.62,26.88 82.5,25 82.5,15.5 82,15 74.48,15 v70.93,11.45 57.05,11.45 v56,12.5 56,20 54,22 54,23.5 53.61,23.89 SV1.15 | v13,8.5 5,8.5 4.5,8 3.5,8 2.5,7 1,7 0.75,7.25 0.75,13.62 | 0.75,13.62 1.62,14.5 1.75,14.5 | 0.75,13.62 0.75,22.25 1.5,23 2.5,23 3.36,22.14 R1.2 | SV1.3 53.5,9.88 53.5,12 53,12.5 49,12.5 47.55,13.95 47.55,16.45 46.75,17.25 44.25,17.25
  Bottom 1.016: 18.55,8.5 v14.75,8.5 v13,8.5 | 18.55,8.5 19.55,7.5 v19.55,4.55 | 18.55,8.5 18.55,11.8 v21.75,15 | SV1.1 52.27,4.27 49,1 43.33,1 | v30,1 43.33,1 | 43.33,1 43.33,5.17 | 40.83,9.18 40.83,13 | 43.33,5.17 40.83,7.67 40.83,9.18 | 43.33,5.17 43.33,6.33 44.5,7.5 v45,7.5 | v36.5,14.78 38,13.28 38,12 40.83,9.18 | 44.25,17.25 43.5,16.5 43.5,14.5 42,13 40.83,13 | 36.8,21.2 v36.8,21.25 37.55,20.5 39,20.5 40.83,18.68 40.83,13

### Text on the board
_tsilk: RST | AUX | CAP | TX | Mini T-Stick | V+ | GND | Controller | v01 | VCC | GND